# Altium schematic sheet NAVIGATION_UNIT.SchDoc
size A4
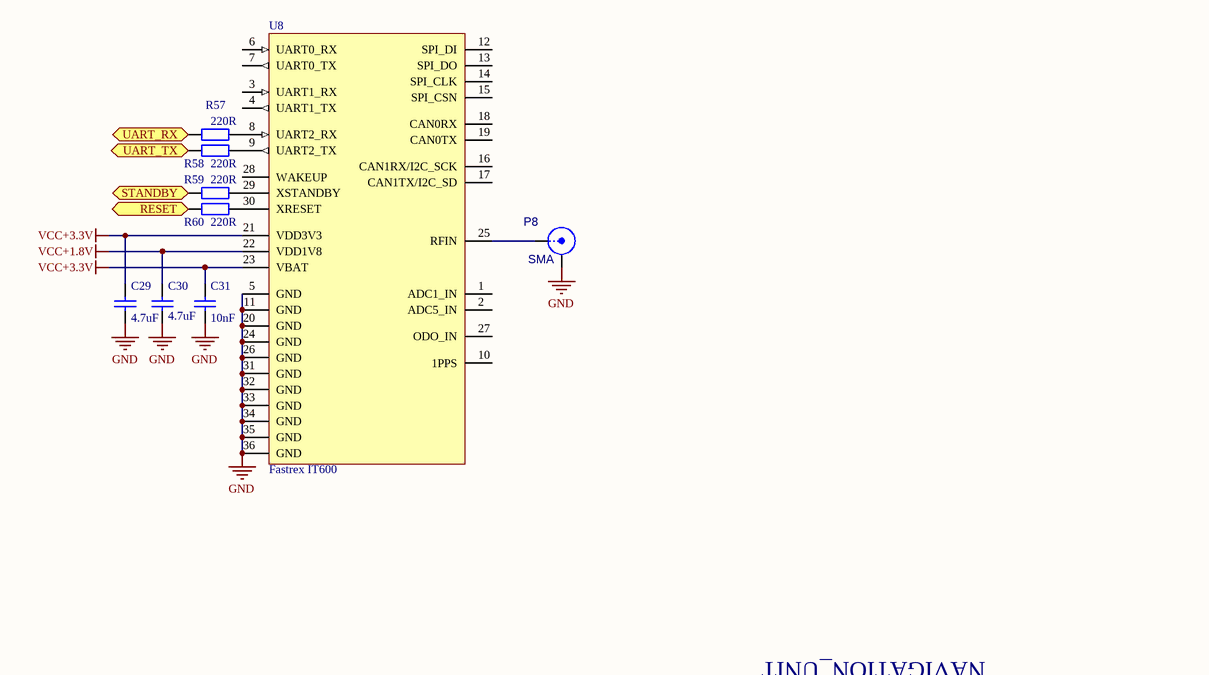
[diagram p0: NAVIGATION_UNIT.SchDoc]

## Parts
C29  value 4.7uF  [C0805]  (hidden comment: 0805)
C30  value 4.7uF  [C0805]  (hidden comment: 0805)
C31  value 10nF  [C0603]  (hidden comment: 0805)
P8  SMA  [SMA]
R57  value 220R  [C0603]  (hidden comment: RES)
R58  value 220R  [C0603]  (hidden comment: RES)
R59  value 220R  [C0603]  (hidden comment: RES)
R60  value 220R  [C0603]  (hidden comment: RES)
U8  Fastrex IT600  [Fastrex_IT600]

## Ports
RESET (in), STANDBY (in), UART_RX (in), UART_TX (out)

## Nets
GND: C29.2 C30.2 C31.2 P8.2(Y) U8.5(GND) U8.11(GND) U8.20(GND) U8.24(GND) U8.26(GND) U8.31(GND) U8.32(GND) U8.33(GND) U8.34(GND) U8.35(GND) U8.36(GND)
VCC+1.8V: C30.1 U8.22(VDD1V8)
VCC+3.3V: C29.1 C31.1 U8.21(VDD3V3) U8.23(VBAT)
RESET: R60.1 ; port RESET
STANDBY: R59.1 ; port STANDBY
UART_RX: R57.1 ; port UART_RX
UART_TX: R58.1 ; port UART_TX
NetP8_1: P8.1(X) U8.25(RFIN)
NetR57_2: R57.2 U8.8(UART2_RX)
NetR58_2: R58.2 U8.9(UART2_TX)
NetR59_2: R59.2 U8.29(XSTANDBY)
NetR60_2: R60.2 U8.30(XRESET)

Not connected (* = marked no-connect by the designer): U8 1(ADC1_IN) 2(ADC5_IN) 3(UART1_RX) 4(UART1_TX) 6(UART0_RX) 7(UART0_TX) 10(1PPS) 12(SPI_DI) 13(SPI_DO) 14(SPI_CLK) 15(SPI_CSN) 16(CAN1RX/I2C_SCK) 17(CAN1TX/I2C_SD) 18(CAN0RX) 19(CAN0TX) 27(ODO_IN) 28(WAKEUP)

## Notes on the sheet
- NAVIGATION_UNIT

## Library data of the parts
C29-C31 = Capasitor_SMD_0805: Capasitor_SMD_0808/
R57-R60 = RES: Resistor
U8 = Fastrax IT600: GPS/ГЛОНАСС
P8 = SMA: LatestRevisionDate: 17-Jul-2002; Publisher: Altium Limited; LatestRevisionNote: Re-released for DXP Platform.; Value: *